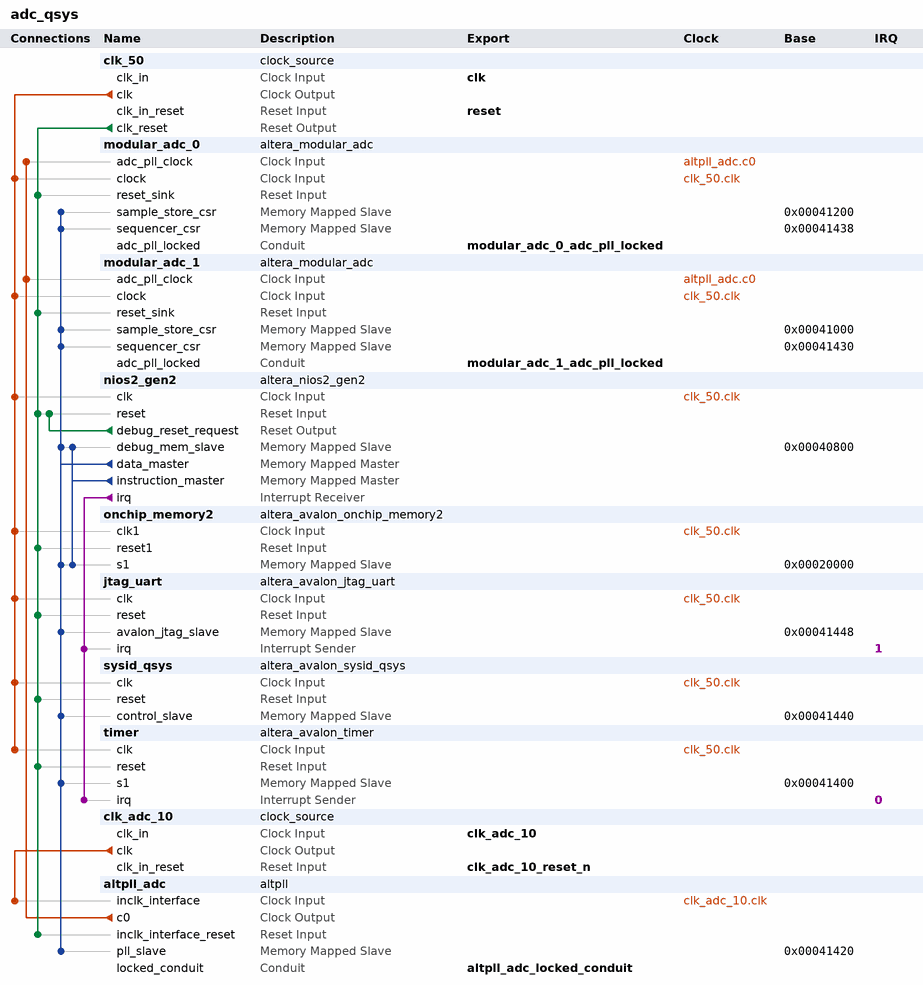
[diagram p0: system contents]
# Platform Designer (Qsys) system adc_qsys, MAX 10 10M50DAF484C6GES
# Parameters at their usual value, and those the tool derives, are not listed.
package require -exact qsys 15.0
create_system adc_qsys
set_project_property DEVICE_FAMILY {MAX 10}
set_project_property DEVICE 10M50DAF484C6GES

add_instance clk_50 clock_source 15.0
set_instance_parameter_value clk_50 clockFrequency 50000000

add_instance modular_adc_0 altera_modular_adc 15.0
set_instance_parameter_value modular_adc_0 CLOCK_FREQ 50000000
set_instance_parameter_value modular_adc_0 CORE_VAR 0
set_instance_parameter_value modular_adc_0 DEVICE_PART 10M50DAF484C6GES
set_instance_parameter_value modular_adc_0 clkdiv 2
set_instance_parameter_value modular_adc_0 int_vref_vr 3.0
set_instance_parameter_value modular_adc_0 refsel 0
set_instance_parameter_value modular_adc_0 seq_order_length 1
set_instance_parameter_value modular_adc_0 seq_order_slot_1 0
set_instance_parameter_value modular_adc_0 seq_order_slot_10 9
set_instance_parameter_value modular_adc_0 seq_order_slot_11 10
set_instance_parameter_value modular_adc_0 seq_order_slot_12 11
set_instance_parameter_value modular_adc_0 seq_order_slot_13 12
set_instance_parameter_value modular_adc_0 seq_order_slot_14 13
set_instance_parameter_value modular_adc_0 seq_order_slot_15 14
set_instance_parameter_value modular_adc_0 seq_order_slot_16 15
set_instance_parameter_value modular_adc_0 seq_order_slot_17 16
set_instance_parameter_value modular_adc_0 seq_order_slot_18 17
set_instance_parameter_value modular_adc_0 seq_order_slot_2 5
set_instance_parameter_value modular_adc_0 seq_order_slot_3 17
set_instance_parameter_value modular_adc_0 seq_order_slot_4 3
set_instance_parameter_value modular_adc_0 seq_order_slot_5 4
set_instance_parameter_value modular_adc_0 seq_order_slot_6 5
set_instance_parameter_value modular_adc_0 seq_order_slot_7 6
set_instance_parameter_value modular_adc_0 seq_order_slot_8 7
set_instance_parameter_value modular_adc_0 seq_order_slot_9 8
set_instance_parameter_value modular_adc_0 tsclkdiv 1
set_instance_parameter_value modular_adc_0 use_ch0 true
set_instance_parameter_value modular_adc_0 use_ch1 false
set_instance_parameter_value modular_adc_0 use_ch2 false
set_instance_parameter_value modular_adc_0 use_ch3 false
set_instance_parameter_value modular_adc_0 use_ch4 false
set_instance_parameter_value modular_adc_0 use_ch5 false
set_instance_parameter_value modular_adc_0 use_ch6 false
set_instance_parameter_value modular_adc_0 use_ch7 false
set_instance_parameter_value modular_adc_0 use_ch8 false
set_instance_parameter_value modular_adc_0 use_tsd false

add_instance modular_adc_1 altera_modular_adc 15.0
set_instance_parameter_value modular_adc_1 CLOCK_FREQ 50000000
set_instance_parameter_value modular_adc_1 CORE_VAR 0
set_instance_parameter_value modular_adc_1 DEVICE_PART 10M50DAF484C6GES
set_instance_parameter_value modular_adc_1 clkdiv 2
set_instance_parameter_value modular_adc_1 int_vref_vr 3.0
set_instance_parameter_value modular_adc_1 ip_is_for_which_adc 2
set_instance_parameter_value modular_adc_1 refsel 0
set_instance_parameter_value modular_adc_1 seq_order_length 1
set_instance_parameter_value modular_adc_1 seq_order_slot_1 0
set_instance_parameter_value modular_adc_1 seq_order_slot_2 30
set_instance_parameter_value modular_adc_1 seq_order_slot_3 30
set_instance_parameter_value modular_adc_1 seq_order_slot_4 30
set_instance_parameter_value modular_adc_1 seq_order_slot_5 30
set_instance_parameter_value modular_adc_1 seq_order_slot_6 30
set_instance_parameter_value modular_adc_1 seq_order_slot_7 30
set_instance_parameter_value modular_adc_1 tsclkdiv 1
set_instance_parameter_value modular_adc_1 use_ch0 true
set_instance_parameter_value modular_adc_1 use_ch1 false
set_instance_parameter_value modular_adc_1 use_ch2 false
set_instance_parameter_value modular_adc_1 use_ch3 false
set_instance_parameter_value modular_adc_1 use_ch4 false
set_instance_parameter_value modular_adc_1 use_ch5 false
set_instance_parameter_value modular_adc_1 use_ch6 false
set_instance_parameter_value modular_adc_1 use_ch7 false
set_instance_parameter_value modular_adc_1 use_ch8 false
set_instance_parameter_value modular_adc_1 use_tsd false

add_instance nios2_gen2 altera_nios2_gen2 15.0
set_instance_parameter_value nios2_gen2 dcache_size 2048
set_instance_parameter_value nios2_gen2 exceptionSlave onchip_memory2.s1
set_instance_parameter_value nios2_gen2 icache_size 4096
set_instance_parameter_value nios2_gen2 impl Fast
set_instance_parameter_value nios2_gen2 resetSlave onchip_memory2.s1

add_instance onchip_memory2 altera_avalon_onchip_memory2 15.0
set_instance_parameter_value onchip_memory2 dataWidth 32
set_instance_parameter_value onchip_memory2 dualPort false
set_instance_parameter_value onchip_memory2 initMemContent false
set_instance_parameter_value onchip_memory2 initializationFileName onchip_mem.hex
set_instance_parameter_value onchip_memory2 memorySize 128000

add_instance jtag_uart altera_avalon_jtag_uart 15.0
set_instance_parameter_value jtag_uart simInteractiveOptions NO_INTERACTIVE_WINDOWS

add_instance sysid_qsys altera_avalon_sysid_qsys 15.0
set_instance_parameter_value sysid_qsys id 0

add_instance timer altera_avalon_timer 15.0
set_instance_parameter_value timer period 1
set_instance_parameter_value timer periodUnits MSEC

add_instance clk_adc_10 clock_source 15.0
set_instance_parameter_value clk_adc_10 clockFrequency 10000000

add_instance altpll_adc altpll 15.0
set_instance_parameter_value altpll_adc CLK0_DIVIDE_BY 1
set_instance_parameter_value altpll_adc CLK0_MULTIPLY_BY 1
set_instance_parameter_value altpll_adc INCLK0_INPUT_FREQUENCY 100000
set_instance_parameter_value altpll_adc PORT_ARESET PORT_USED
set_instance_parameter_value altpll_adc PORT_LOCKED PORT_USED
set_instance_parameter_value altpll_adc PORT_clk1 PORT_UNUSED
set_instance_parameter_value altpll_adc PORT_clk2 PORT_UNUSED
set_instance_parameter_value altpll_adc PORT_clk3 PORT_UNUSED

# connections
add_connection altpll_adc.c0 modular_adc_0.adc_pll_clock clock
add_connection altpll_adc.c0 modular_adc_1.adc_pll_clock clock
add_connection clk_50.clk jtag_uart.clk clock
add_connection clk_50.clk modular_adc_0.clock clock
add_connection clk_50.clk modular_adc_1.clock clock
add_connection clk_50.clk nios2_gen2.clk clock
add_connection clk_50.clk onchip_memory2.clk1 clock
add_connection clk_50.clk sysid_qsys.clk clock
add_connection clk_50.clk timer.clk clock
add_connection clk_adc_10.clk altpll_adc.inclk_interface clock
add_connection clk_50.clk_reset altpll_adc.inclk_interface_reset reset
add_connection clk_50.clk_reset jtag_uart.reset reset
add_connection clk_50.clk_reset modular_adc_0.reset_sink reset
add_connection clk_50.clk_reset modular_adc_1.reset_sink reset
add_connection clk_50.clk_reset nios2_gen2.reset reset
add_connection clk_50.clk_reset onchip_memory2.reset1 reset
add_connection clk_50.clk_reset sysid_qsys.reset reset
add_connection clk_50.clk_reset timer.reset reset
add_connection nios2_gen2.debug_reset_request nios2_gen2.reset reset
add_connection nios2_gen2.data_master altpll_adc.pll_slave avalon
set_connection_parameter_value nios2_gen2.data_master/altpll_adc.pll_slave baseAddress 0x00041420
add_connection nios2_gen2.data_master jtag_uart.avalon_jtag_slave avalon
set_connection_parameter_value nios2_gen2.data_master/jtag_uart.avalon_jtag_slave baseAddress 0x00041448
add_connection nios2_gen2.data_master modular_adc_0.sample_store_csr avalon
set_connection_parameter_value nios2_gen2.data_master/modular_adc_0.sample_store_csr baseAddress 0x00041200
add_connection nios2_gen2.data_master modular_adc_0.sequencer_csr avalon
set_connection_parameter_value nios2_gen2.data_master/modular_adc_0.sequencer_csr baseAddress 0x00041438
add_connection nios2_gen2.data_master modular_adc_1.sample_store_csr avalon
set_connection_parameter_value nios2_gen2.data_master/modular_adc_1.sample_store_csr baseAddress 0x00041000
add_connection nios2_gen2.data_master modular_adc_1.sequencer_csr avalon
set_connection_parameter_value nios2_gen2.data_master/modular_adc_1.sequencer_csr baseAddress 0x00041430
add_connection nios2_gen2.data_master nios2_gen2.debug_mem_slave avalon
set_connection_parameter_value nios2_gen2.data_master/nios2_gen2.debug_mem_slave baseAddress 0x00040800
add_connection nios2_gen2.data_master onchip_memory2.s1 avalon
set_connection_parameter_value nios2_gen2.data_master/onchip_memory2.s1 baseAddress 0x00020000
add_connection nios2_gen2.data_master sysid_qsys.control_slave avalon
set_connection_parameter_value nios2_gen2.data_master/sysid_qsys.control_slave baseAddress 0x00041440
add_connection nios2_gen2.data_master timer.s1 avalon
set_connection_parameter_value nios2_gen2.data_master/timer.s1 baseAddress 0x00041400
add_connection nios2_gen2.instruction_master nios2_gen2.debug_mem_slave avalon
set_connection_parameter_value nios2_gen2.instruction_master/nios2_gen2.debug_mem_slave baseAddress 0x00040800
add_connection nios2_gen2.instruction_master onchip_memory2.s1 avalon
set_connection_parameter_value nios2_gen2.instruction_master/onchip_memory2.s1 baseAddress 0x00020000
add_connection nios2_gen2.irq jtag_uart.irq interrupt
set_connection_parameter_value nios2_gen2.irq/jtag_uart.irq irqNumber 1
add_connection nios2_gen2.irq timer.irq interrupt
set_connection_parameter_value nios2_gen2.irq/timer.irq irqNumber 0

# exported interfaces
add_interface altpll_adc_locked_conduit conduit end
set_interface_property altpll_adc_locked_conduit EXPORT_OF altpll_adc.locked_conduit
add_interface clk clock sink
set_interface_property clk EXPORT_OF clk_50.clk_in
add_interface clk_adc_10 clock sink
set_interface_property clk_adc_10 EXPORT_OF clk_adc_10.clk_in
add_interface clk_adc_10_reset_n reset sink
set_interface_property clk_adc_10_reset_n EXPORT_OF clk_adc_10.clk_in_reset
add_interface modular_adc_0_adc_pll_locked conduit end
set_interface_property modular_adc_0_adc_pll_locked EXPORT_OF modular_adc_0.adc_pll_locked
add_interface modular_adc_1_adc_pll_locked conduit end
set_interface_property modular_adc_1_adc_pll_locked EXPORT_OF modular_adc_1.adc_pll_locked
add_interface reset reset sink
set_interface_property reset EXPORT_OF clk_50.clk_in_reset

set_interconnect_requirement {$system} qsys_mm.clockCrossingAdapter HANDSHAKE
set_interconnect_requirement {$system} qsys_mm.insertDefaultSlave FALSE
set_interconnect_requirement {$system} qsys_mm.maxAdditionalLatency 1

save_system adc_qsys.qsys
